# Altium schematic sheet Interface_Protection.SchDoc: SVPXFMC Carrier 3U
size A4; CheckedBy: \; Author: G.Kasprowicz; CompanyName: ISE; DrawnBy: T.Przywozki; Organization: WUT ISE; Address1: Warsaw University of Technology; Address2: Nowowiejska 15/19 00-665 Warsaw; Revision: 1.0.; SheetNumber: 10; SheetTotal: 20; Project: SVPXFMC Carrier 3U; ModifiedBy: -; CheckedDate: -; Title2: Interface Protection; DivGrp: ISE; Designer: G. Kasprowicz
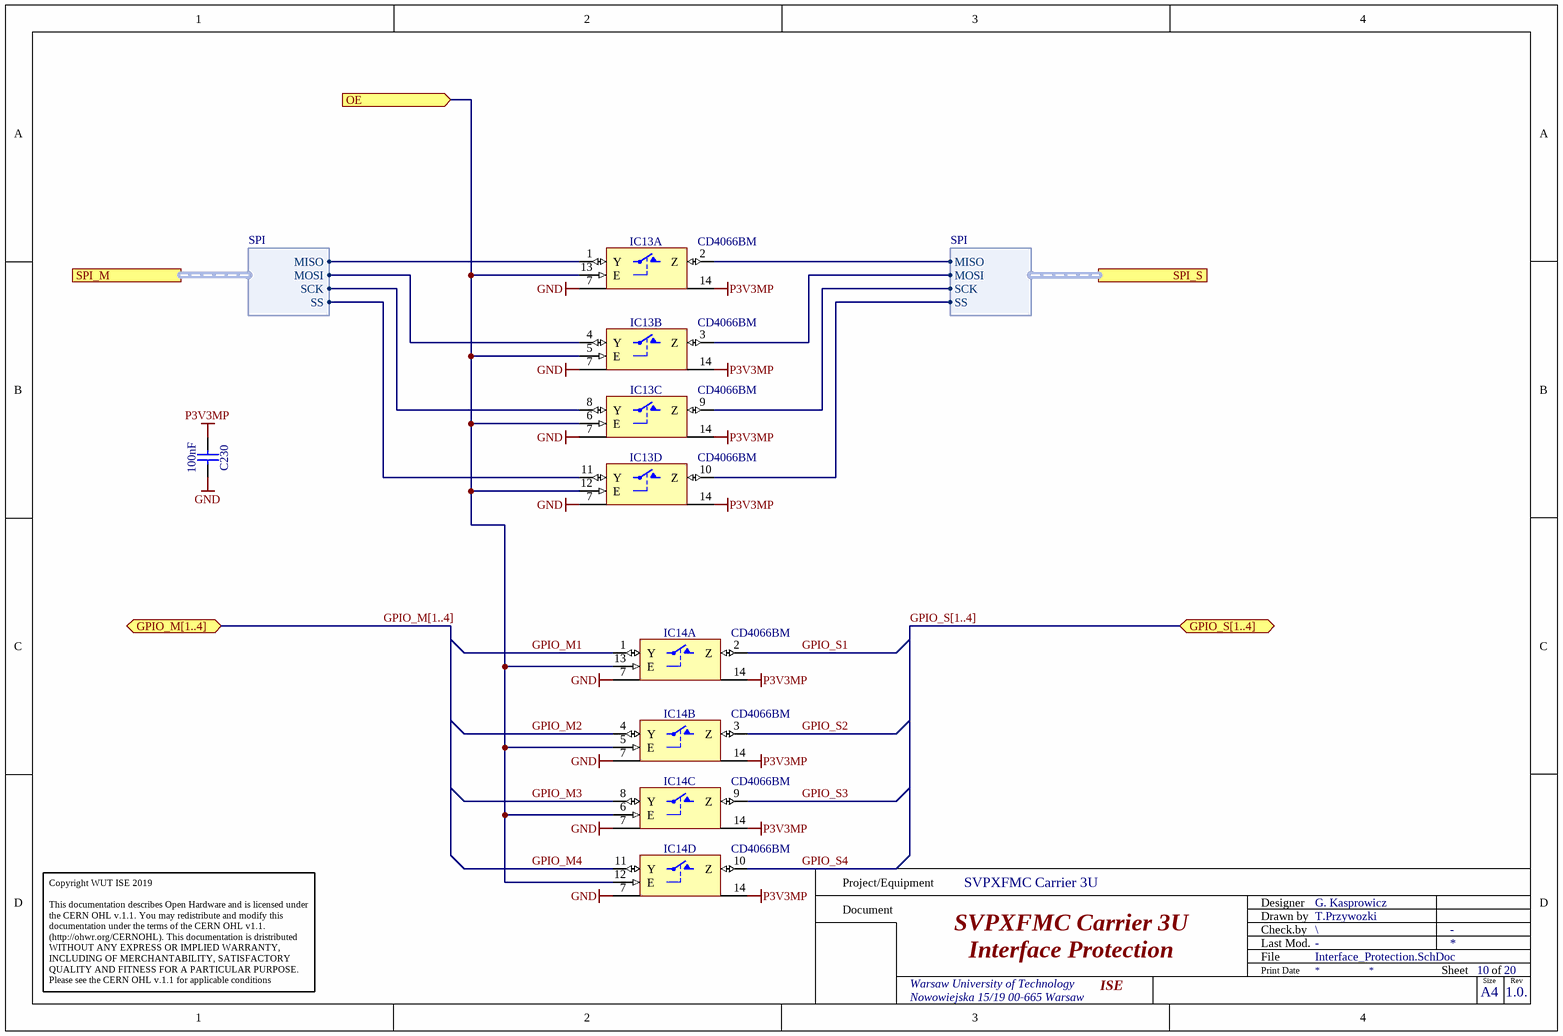
[diagram p0: Interface_Protection.SchDoc]

## Parts
C230  100nF  [CAPC1005X55N]
IC13  CD4066BM  [SOIC127P600X175-14N]  (parts A,B,C,D of 4)
IC14  CD4066BM  [SOIC127P600X175-14N]  (parts A,B,C,D of 4)

## Ports
GPIO_M[1..4] (bidir), GPIO_S[1..4] (bidir), OE (in), SPI_M (harness SPI), SPI_S (harness SPI)

## Harnesses
SPI: MISO, MOSI, SCK, SS

## Nets
GND: C230.2 IC13.7(VSS) IC14.7(VSS)
P3V3MP: C230.1 IC13.14(VDD) IC14.14(VDD)  [also labelled VDD]
GPIO_M1: IC14.1(Y)
GPIO_M2: IC14.4(Y)
GPIO_M3: IC14.8(Y)
GPIO_M4: IC14.11(Y)
GPIO_S1: IC14.2(Z)
GPIO_S2: IC14.3(Z)
GPIO_S3: IC14.9(Z)
GPIO_S4: IC14.10(Z)
OE: IC13.5(E) IC13.6(E) IC13.12(E) IC13.13(E) IC14.5(E) IC14.6(E) IC14.12(E) IC14.13(E) ; port OE
NetIC13_1: IC13.1(Y) ; port SPI_M.MISO
NetIC13_2: IC13.2(Z) ; port SPI_S.MISO
NetIC13_3: IC13.3(Z) ; port SPI_S.MOSI
NetIC13_4: IC13.4(Y) ; port SPI_M.MOSI
NetIC13_8: IC13.8(Y) ; port SPI_M.SCK
NetIC13_9: IC13.9(Z) ; port SPI_S.SCK
NetIC13_10: IC13.10(Z) ; port SPI_S.SS
NetIC13_11: IC13.11(Y) ; port SPI_M.SS

## Buses and harness runs
bus GPIO_M[1..4] = port GPIO_M[1..4]
bus GPIO_S[1..4] = port GPIO_S[1..4]

## Notes on the sheet
- Project/Equipment
- Document
- Designer
- Drawn by
- Check.by
- Copyright WUT ISE 2019
  This documentation describes Open Hardware and is licensed under the CERN OHL v.1.1. You may redistribute and modify this documentation under the terms of the CERN OHL v1.1.
  (http://ohwr.org/CERNOHL). This documentation is dristributed WITHOUT ANY EXPRESS OR IMPLIED WARRANTY, INCLUDING OF MERCHANTABILITY, SATISFACTORY QUALITY AND FITNESS FOR A PARTICULAR PURPOSE. Please see the CERN OHL v.1.1 for applicable conditions
- File
- Last Mod.
- Print Date
- Sheet
- Size
- A4
- of
- Rev

## Library data of the parts
C230 = CC0402_100NF_25V_10%_X7R_YUDEN_TMK105B7104KVHF: Non-polarised capacitor; Part Description: SMD Multilayer Chip Ceramic Capacitor (High Dielectric Type) for Automotive / Industrial Applications; Manufacturer: TAIYO YUDEN; Voltage: 25V; TC: X7R; Tolerance: ±10%; Part Number: CC0402_100NF_25V_10%_X7R_YUDEN_TMK105B7104KVHF; Component Kind: Standard; Component Type: Standard; Pin Count: 2; Value: 100nF; Status: Not Recommended; Manufacturer Part Number: TMK105B7104KVHF; Case: 0402; Mounted: Yes; Socket: No; SMD: Yes; Sense: No; HelpURL: \\cern.ch\dfs\Applications\Altium\Datasheets\CC0402_TAIYO-YUDEN_TMK105B7104KVHF.pdf; Author: CERN DEM JLC; CreateDate: 10/05/2017; LatestRevisionDate: 10/05/2017; ComponentHeight: 0.55mm
IC13 IC14 = CD4066BM: Part Description: CMOS Quad Bilateral Switch; Manufacturer: TEXAS INSTRUMENTS; PressFit: No; Bonding: No; Part Number: CD4066BM; Component Kind: Standard; Component Type: Standard; Device: CD4066BM; PackageDescription: SOIC 14, Pitch 1.27mm - Body 4x8.75mm, IPC Medium Density; Manufacturer Part Number: CD4066BM; Pin Count: 14; Case: SOIC14; Mounted: Yes; Socket: No; SMD: Yes; Sense: No; ComponentHeight: 1.75mm; Author: CERN DEM MR; HelpURL: \\cern.ch\dfs\Applications\Altium\Datasheets\CD4066BM.pdf; CreateDate: 2016-01-21; LatestRevisionDate: 2016-01-21